# Altium project zynq_dev_V1.PrjPcb (part 3 of 3)

## Sheet [06] - MEMORY.SchDoc
size A3; DocumentNumber: 3; SheetNumber: 3; SheetTotal: 4
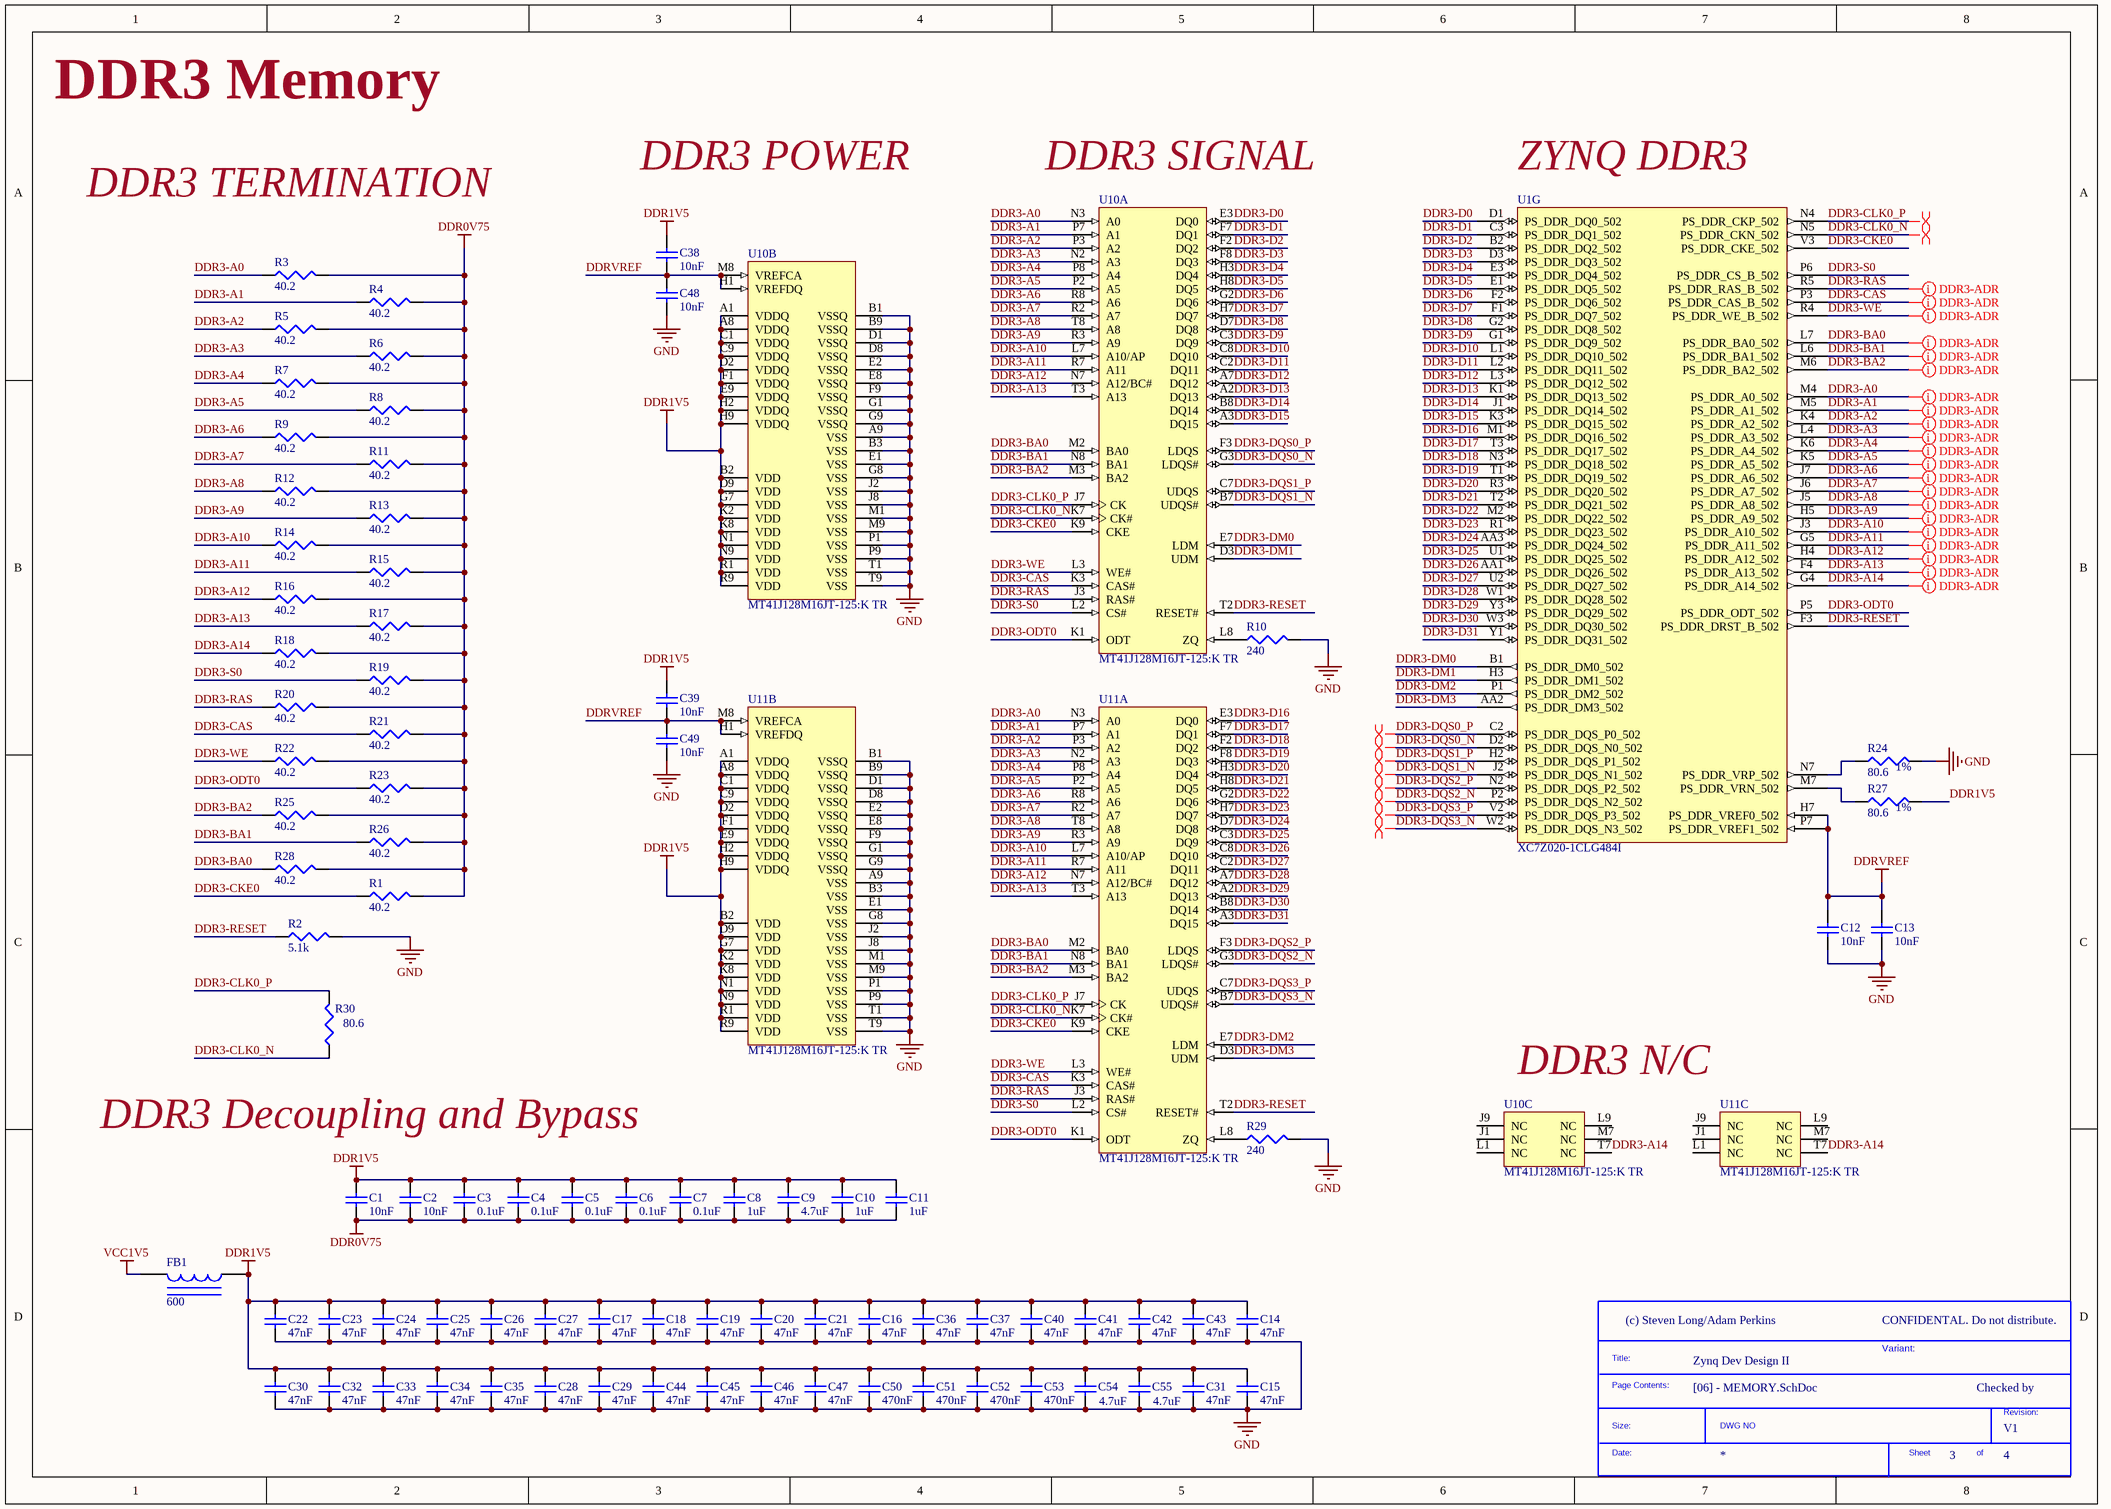
[diagram p5: [06] - MEMORY.SchDoc]

### Parts
(Parts that share a designator on the sheet are numbered #1, #2 ... from top to bottom, then left to right.)
*#6  SDTitleBlock  (value not drawn)  (graphical)
C1  value 10nF  [0402]  (hidden comment: Capacitor)
C2  value 10nF  [0402]  (hidden comment: Capacitor)
C3  value 0.1uF  [0402]  (hidden comment: Capacitor)
C4  value 0.1uF  [0402]  (hidden comment: Capacitor)
C5  value 0.1uF  [0402]  (hidden comment: Capacitor)
C6  value 0.1uF  [0402]  (hidden comment: Capacitor)
C7  value 0.1uF  [0402]  (hidden comment: Capacitor)
C8  value 1uF  [1608[0603]]  (hidden comment: Capacitor)
C9  value 4.7uF  [1608[0603]]  (hidden comment: Capacitor)
C10  value 1uF  [1608[0603]]  (hidden comment: Capacitor)
C11  value 1uF  [1608[0603]]  (hidden comment: Capacitor)
C12  value 10nF  [0402]  (hidden comment: Capacitor)
C13  value 10nF  [0402]  (hidden comment: Capacitor)
C14  value 47nF  [0402]  (hidden comment: Capacitor)
C15  value 47nF  [0402]  (hidden comment: Capacitor)
C16  value 47nF  [0402]  (hidden comment: Capacitor)
C17  value 47nF  [0402]  (hidden comment: Capacitor)
C18  value 47nF  [0402]  (hidden comment: Capacitor)
C19  value 47nF  [0402]  (hidden comment: Capacitor)
C20  value 47nF  [0402]  (hidden comment: Capacitor)
C21  value 47nF  [0402]  (hidden comment: Capacitor)
C22  value 47nF  [0402]  (hidden comment: Capacitor)
C23  value 47nF  [0402]  (hidden comment: Capacitor)
C24  value 47nF  [0402]  (hidden comment: Capacitor)
C25  value 47nF  [0402]  (hidden comment: Capacitor)
C26  value 47nF  [0402]  (hidden comment: Capacitor)
C27  value 47nF  [0402]  (hidden comment: Capacitor)
C28  value 47nF  [0402]  (hidden comment: Capacitor)
C29  value 47nF  [0402]  (hidden comment: Capacitor)
C30  value 47nF  [0402]  (hidden comment: Capacitor)
C31  value 47nF  [0402]  (hidden comment: Capacitor)
C32  value 47nF  [0402]  (hidden comment: Capacitor)
C33  value 47nF  [0402]  (hidden comment: Capacitor)
C34  value 47nF  [0402]  (hidden comment: Capacitor)
C35  value 47nF  [0402]  (hidden comment: Capacitor)
C36  value 47nF  [0402]  (hidden comment: Capacitor)
C37  value 47nF  [0402]  (hidden comment: Capacitor)
C38  value 10nF  [0402]  (hidden comment: Capacitor)
C39  value 10nF  [0402]  (hidden comment: Capacitor)
C40  value 47nF  [0402]  (hidden comment: Capacitor)
C41  value 47nF  [0402]  (hidden comment: Capacitor)
C42  value 47nF  [0402]  (hidden comment: Capacitor)
C43  value 47nF  [0402]  (hidden comment: Capacitor)
C44  value 47nF  [0402]  (hidden comment: Capacitor)
C45  value 47nF  [0402]  (hidden comment: Capacitor)
C46  value 47nF  [0402]  (hidden comment: Capacitor)
C47  value 47nF  [0402]  (hidden comment: Capacitor)
C48  value 10nF  [0402]  (hidden comment: Capacitor)
C49  value 10nF  [0402]  (hidden comment: Capacitor)
C50  value 470nF  [0402]  (hidden comment: Capacitor)
C51  value 470nF  [0402]  (hidden comment: Capacitor)
C52  value 470nF  [0402]  (hidden comment: Capacitor)
C53  value 470nF  [0402]  (hidden comment: Capacitor)
C54  value 4.7uF  [1608[0603]]  (hidden comment: Capacitor)
C55  value 4.7uF  [1608[0603]]  (hidden comment: Capacitor)
FB1  value 600  [6-0805_N]  (hidden comment: Ferrite Bead)
R1  value 40.2  [0402]  (hidden comment: Resistor)
R2  value 5.1k  [0402]  (hidden comment: Resistor)
R3  value 40.2  [0402]  (hidden comment: Resistor)
R4  value 40.2  [0402]  (hidden comment: Resistor)
R5  value 40.2  [0402]  (hidden comment: Resistor)
R6  value 40.2  [0402]  (hidden comment: Resistor)
R7  value 40.2  [0402]  (hidden comment: Resistor)
R8  value 40.2  [0402]  (hidden comment: Resistor)
R9  value 40.2  [0402]  (hidden comment: Resistor)
R10  value 240  [0402]  (hidden comment: Resistor)
R11  value 40.2  [0402]  (hidden comment: Resistor)
R12  value 40.2  [0402]  (hidden comment: Resistor)
R13  value 40.2  [0402]  (hidden comment: Resistor)
R14  value 40.2  [0402]  (hidden comment: Resistor)
R15  value 40.2  [0402]  (hidden comment: Resistor)
R16  value 40.2  [0402]  (hidden comment: Resistor)
R17  value 40.2  [0402]  (hidden comment: Resistor)
R18  value 40.2  [0402]  (hidden comment: Resistor)
R19  value 40.2  [0402]  (hidden comment: Resistor)
R20  value 40.2  [0402]  (hidden comment: Resistor)
R21  value 40.2  [0402]  (hidden comment: Resistor)
R22  value 40.2  [0402]  (hidden comment: Resistor)
R23  value 40.2  [0402]  (hidden comment: Resistor)
R24  value 80.6  Tolerance: 1%  [0402]  (hidden comment: Resistor)
R25  value 40.2  [0402]  (hidden comment: Resistor)
R26  value 40.2  [0402]  (hidden comment: Resistor)
R27  value 80.6  Tolerance: 1%  [0402]  (hidden comment: Resistor)
R28  value 40.2  [0402]  (hidden comment: Resistor)
R29  value 240  [0402]  (hidden comment: Resistor)
R30  value 80.6  [0402]  (hidden comment: Resistor)
U1  XC7Z020-1CLG484I  [CLG484]  (part G of 10)
U10  MT41J128M16JT-125:K TR  [MICT-JT-96]  (parts A,B,C of 3)
U11  MT41J128M16JT-125:K TR  [MICT-JT-96]  (parts A,B,C of 3)

### Nets
DDR0V75: C1.1 C2.1 C3.1 C4.1 C5.1 C6.1 C7.1 C8.1 C9.1 C10.1 C11.1 R1.2 R3.2 R4.2 R5.2 R6.2 R7.2 R8.2 R9.2 R11.2 R12.2 R13.2 R14.2 R15.2 R16.2 R17.2 R18.2 R19.2 R20.2 R21.2 R22.2 R23.2 R25.2 R26.2 R28.2
DDR1V5: C1.2 C2.2 C3.2 C4.2 C5.2 C6.2 C7.2 C8.2 C9.2 C10.2 C11.2 C14.2 C15.2 C16.2 C17.2 C18.2 C19.2 C20.2 C21.2 C22.2 C23.2 C24.2 C25.2 C26.2 C27.2 C28.2 C29.2 C30.2 C31.2 C32.2 C33.2 C34.2 C35.2 C36.2 C37.2 C38.2 C39.2 C40.2 C41.2 C42.2 C43.2 C44.2 C45.2 C46.2 C47.2 C50.2 C51.2 C52.2 C53.2 C54.2 C55.2 FB1.1 R27.2 U10.A1(VDDQ) U10.A8(VDDQ) U10.B2(VDD) U10.C1(VDDQ) U10.C9(VDDQ) U10.D2(VDDQ) U10.D9(VDD) U10.E9(VDDQ) U10.F1(VDDQ) U10.G7(VDD) U10.H2(VDDQ) U10.H9(VDDQ) U10.K2(VDD) U10.K8(VDD) U10.N1(VDD) U10.N9(VDD) U10.R1(VDD) U10.R9(VDD) U11.A1(VDDQ) U11.A8(VDDQ) U11.B2(VDD) U11.C1(VDDQ) U11.C9(VDDQ) U11.D2(VDDQ) U11.D9(VDD) U11.E9(VDDQ) U11.F1(VDDQ) U11.G7(VDD) U11.H2(VDDQ) U11.H9(VDDQ) U11.K2(VDD) U11.K8(VDD) U11.N1(VDD) U11.N9(VDD) U11.R1(VDD) U11.R9(VDD)
DDRVREF: C12.2 C13.2 C38.1 C39.1 C48.2 C49.2 U1.H7(PS_DDR_VREF0_502) U1.P7(PS_DDR_VREF1_502) U10.H1(VREFDQ) U10.M8(VREFCA) U11.H1(VREFDQ) U11.M8(VREFCA)
GND: C12.1 C13.1 C14.1 C15.1 C16.1 C17.1 C18.1 C19.1 C20.1 C21.1 C22.1 C23.1 C24.1 C25.1 C26.1 C27.1 C28.1 C29.1 C30.1 C31.1 C32.1 C33.1 C34.1 C35.1 C36.1 C37.1 C40.1 C41.1 C42.1 C43.1 C44.1 C45.1 C46.1 C47.1 C48.1 C49.1 C50.1 C51.1 C52.1 C53.1 C54.1 C55.1 R2.2 R10.2 R24.2 R29.2 U10.A9(VSS) U10.B1(VSSQ) U10.B3(VSS) U10.B9(VSSQ) U10.D1(VSSQ) U10.D8(VSSQ) U10.E1(VSS) U10.E2(VSSQ) U10.E8(VSSQ) U10.F9(VSSQ) U10.G1(VSSQ) U10.G8(VSS) U10.G9(VSSQ) U10.J2(VSS) U10.J8(VSS) U10.M1(VSS) U10.M9(VSS) U10.P1(VSS) U10.P9(VSS) U10.T1(VSS) U10.T9(VSS) U11.A9(VSS) U11.B1(VSSQ) U11.B3(VSS) U11.B9(VSSQ) U11.D1(VSSQ) U11.D8(VSSQ) U11.E1(VSS) U11.E2(VSSQ) U11.E8(VSSQ) U11.F9(VSSQ) U11.G1(VSSQ) U11.G8(VSS) U11.G9(VSSQ) U11.J2(VSS) U11.J8(VSS) U11.M1(VSS) U11.M9(VSS) U11.P1(VSS) U11.P9(VSS) U11.T1(VSS) U11.T9(VSS)
VCC1V5: FB1.2
DDR3-A0: R3.1 U1.M4(PS_DDR_A0_502) U10.N3(A0) U11.N3(A0)
DDR3-A1: R4.1 U1.M5(PS_DDR_A1_502) U10.P7(A1) U11.P7(A1)
DDR3-A2: R5.1 U1.K4(PS_DDR_A2_502) U10.P3(A2) U11.P3(A2)
DDR3-A3: R6.1 U1.L4(PS_DDR_A3_502) U10.N2(A3) U11.N2(A3)
DDR3-A4: R7.1 U1.K6(PS_DDR_A4_502) U10.P8(A4) U11.P8(A4)
DDR3-A5: R8.1 U1.K5(PS_DDR_A5_502) U10.P2(A5) U11.P2(A5)
DDR3-A6: R9.1 U1.J7(PS_DDR_A6_502) U10.R8(A6) U11.R8(A6)
DDR3-A7: R11.1 U1.J6(PS_DDR_A7_502) U10.R2(A7) U11.R2(A7)
DDR3-A8: R12.1 U1.J5(PS_DDR_A8_502) U10.T8(A8) U11.T8(A8)
DDR3-A9: R13.1 U1.H5(PS_DDR_A9_502) U10.R3(A9) U11.R3(A9)
DDR3-A10: R14.1 U1.J3(PS_DDR_A10_502) U10.L7(A10/AP) U11.L7(A10/AP)
DDR3-A11: R15.1 U1.G5(PS_DDR_A11_502) U10.R7(A11) U11.R7(A11)
DDR3-A12: R16.1 U1.H4(PS_DDR_A12_502) U10.N7(A12/BC#) U11.N7(A12/BC#)
DDR3-A13: R17.1 U1.F4(PS_DDR_A13_502) U10.T3(A13) U11.T3(A13)
DDR3-A14: R18.1 U1.G4(PS_DDR_A14_502) U10.T7(NC) U11.T7(NC)
DDR3-BA0: R28.1 U1.L7(PS_DDR_BA0_502) U10.M2(BA0) U11.M2(BA0)
DDR3-BA1: R26.1 U1.L6(PS_DDR_BA1_502) U10.N8(BA1) U11.N8(BA1)
DDR3-BA2: R25.1 U1.M6(PS_DDR_BA2_502) U10.M3(BA2) U11.M3(BA2)
DDR3-CAS: R21.1 U1.P3(PS_DDR_CAS_B_502) U10.K3(CAS#) U11.K3(CAS#)
DDR3-CKE0: R1.1 U1.V3(PS_DDR_CKE_502) U10.K9(CKE) U11.K9(CKE)
DDR3-CLK0_N: R30.1 U1.N5(PS_DDR_CKN_502) U10.K7(CK#) U11.K7(CK#)
DDR3-CLK0_P: R30.2 U1.N4(PS_DDR_CKP_502) U10.J7(CK) U11.J7(CK)
DDR3-D0: U1.D1(PS_DDR_DQ0_502) U10.E3(DQ0)
DDR3-D1: U1.C3(PS_DDR_DQ1_502) U10.F7(DQ1)
DDR3-D2: U1.B2(PS_DDR_DQ2_502) U10.F2(DQ2)
DDR3-D3: U1.D3(PS_DDR_DQ3_502) U10.F8(DQ3)
DDR3-D4: U1.E3(PS_DDR_DQ4_502) U10.H3(DQ4)
DDR3-D5: U1.E1(PS_DDR_DQ5_502) U10.H8(DQ5)
DDR3-D6: U1.F2(PS_DDR_DQ6_502) U10.G2(DQ6)
DDR3-D7: U1.F1(PS_DDR_DQ7_502) U10.H7(DQ7)
DDR3-D8: U1.G2(PS_DDR_DQ8_502) U10.D7(DQ8)
DDR3-D9: U1.G1(PS_DDR_DQ9_502) U10.C3(DQ9)
DDR3-D10: U1.L1(PS_DDR_DQ10_502) U10.C8(DQ10)
DDR3-D11: U1.L2(PS_DDR_DQ11_502) U10.C2(DQ11)
DDR3-D12: U1.L3(PS_DDR_DQ12_502) U10.A7(DQ12)
DDR3-D13: U1.K1(PS_DDR_DQ13_502) U10.A2(DQ13)
DDR3-D14: U1.J1(PS_DDR_DQ14_502) U10.B8(DQ14)
DDR3-D15: U1.K3(PS_DDR_DQ15_502) U10.A3(DQ15)
DDR3-D16: U1.M1(PS_DDR_DQ16_502) U11.E3(DQ0)
DDR3-D17: U1.T3(PS_DDR_DQ17_502) U11.F7(DQ1)
DDR3-D18: U1.N3(PS_DDR_DQ18_502) U11.F2(DQ2)
DDR3-D19: U1.T1(PS_DDR_DQ19_502) U11.F8(DQ3)
DDR3-D20: U1.R3(PS_DDR_DQ20_502) U11.H3(DQ4)
DDR3-D21: U1.T2(PS_DDR_DQ21_502) U11.H8(DQ5)
DDR3-D22: U1.M2(PS_DDR_DQ22_502) U11.G2(DQ6)
DDR3-D23: U1.R1(PS_DDR_DQ23_502) U11.H7(DQ7)
DDR3-D24: U1.AA3(PS_DDR_DQ24_502) U11.D7(DQ8)
DDR3-D25: U1.U1(PS_DDR_DQ25_502) U11.C3(DQ9)
DDR3-D26: U1.AA1(PS_DDR_DQ26_502) U11.C8(DQ10)
DDR3-D27: U1.U2(PS_DDR_DQ27_502) U11.C2(DQ11)
DDR3-D28: U1.W1(PS_DDR_DQ28_502) U11.A7(DQ12)
DDR3-D29: U1.Y3(PS_DDR_DQ29_502) U11.A2(DQ13)
DDR3-D30: U1.W3(PS_DDR_DQ30_502) U11.B8(DQ14)
DDR3-D31: U1.Y1(PS_DDR_DQ31_502) U11.A3(DQ15)
DDR3-DM0: U1.B1(PS_DDR_DM0_502) U10.E7(LDM)
DDR3-DM1: U1.H3(PS_DDR_DM1_502) U10.D3(UDM)
DDR3-DM2: U1.P1(PS_DDR_DM2_502) U11.E7(LDM)
DDR3-DM3: U1.AA2(PS_DDR_DM3_502) U11.D3(UDM)
DDR3-DQS0_N: U1.D2(PS_DDR_DQS_N0_502) U10.G3(LDQS#)
DDR3-DQS0_P: U1.C2(PS_DDR_DQS_P0_502) U10.F3(LDQS)
DDR3-DQS1_N: U1.J2(PS_DDR_DQS_N1_502) U10.B7(UDQS#)
DDR3-DQS1_P: U1.H2(PS_DDR_DQS_P1_502) U10.C7(UDQS)
DDR3-DQS2_N: U1.P2(PS_DDR_DQS_N2_502) U11.G3(LDQS#)
DDR3-DQS2_P: U1.N2(PS_DDR_DQS_P2_502) U11.F3(LDQS)
DDR3-DQS3_N: U1.W2(PS_DDR_DQS_N3_502) U11.B7(UDQS#)
DDR3-DQS3_P: U1.V2(PS_DDR_DQS_P3_502) U11.C7(UDQS)
DDR3-ODT0: R23.1 U1.P5(PS_DDR_ODT_502) U10.K1(ODT) U11.K1(ODT)
DDR3-RAS: R20.1 U1.R5(PS_DDR_RAS_B_502) U10.J3(RAS#) U11.J3(RAS#)
DDR3-RESET: R2.1 U1.F3(PS_DDR_DRST_B_502) U10.T2(RESET#) U11.T2(RESET#)
DDR3-S0: R19.1 U1.P6(PS_DDR_CS_B_502) U10.L2(CS#) U11.L2(CS#)
DDR3-WE: R22.1 U1.R4(PS_DDR_WE_B_502) U10.L3(WE#) U11.L3(WE#)
NetR10_1: R10.1 U10.L8(ZQ)
NetR24_1: R24.1 U1.N7(PS_DDR_VRP_502)
NetR27_1: R27.1 U1.M7(PS_DDR_VRN_502)
NetR29_1: R29.1 U11.L8(ZQ)

Not connected (* = marked no-connect by the designer): U10 J1(NC) J9(NC) L1(NC) L9(NC) M7(NC); U11 J1(NC) J9(NC) L1(NC) L9(NC) M7(NC)

### Layout directives
differential pair: DDR3-CLK0_N, DDR3-CLK0_P, DDR3-DQS0_N, DDR3-DQS0_P, DDR3-DQS1_N, DDR3-DQS1_P, DDR3-DQS2_N, DDR3-DQS2_P, DDR3-DQS3_N, DDR3-DQS3_P
net class DDR3-ADR: DDR3-A0, DDR3-A1, DDR3-A2, DDR3-A3, DDR3-A4, DDR3-A5, DDR3-A6, DDR3-A7, DDR3-A8, DDR3-A9, DDR3-A10, DDR3-A11, DDR3-A12, DDR3-A13, DDR3-A14, DDR3-BA0, DDR3-BA1, DDR3-BA2, DDR3-CAS, DDR3-RAS, DDR3-WE

### Notes on the sheet
- DDR3 Memory
- DDR3 POWER
- (near U10) DDR3 SIGNAL
- (near U1) ZYNQ DDR3
- DDR3 TERMINATION
- DDR3 N/C
- DDR3 Decoupling and Bypass
- CONFIDENTAL. Do not distribute.
- CLOCKS (CPU & PCIE)
- Variant:
- Checked by
- (in symbol SDTitleBlock) Title:; Page Contents:; Revision:; Size:; DWG NO; Date:; Sheet; of

### Library data of the parts
C1-C55 = Cap Semi: Capacitor (Semiconductor SIM Model); Published: 8-Jun-2000; LatestRevisionDate: 29-May-2009; LatestRevisionNote: IPC-7351 Footprint Added.; PackageReference: C1206; Publisher: Altium Limited; PackageDescription: Chip Capacitor
FB1 = Inductor Iron: Magnetic-Core Inductor; Published: 24-Mar-1999; LatestRevisionDate: 17-Jul-2002; LatestRevisionNote: Re-released for DXP Platform.; PackageReference: AXIAL-0.9; Publisher: Altium Limited; PackageDescription: Axial Device, Thru-Hole; 2 Leads; 0.9 in Pin Spacing
R1-R29 = Res3: Published: 8-Jun-2000; LatestRevisionDate: 29-May-2009; LatestRevisionNote: IPC-7351 Footprint Added.; PackageReference: J1-0603; Publisher: Altium Limited; PackageDescription: Chip Resistor
R30 = Res3: Tolerance: 1%; Published: 8-Jun-2000; LatestRevisionDate: 29-May-2009; LatestRevisionNote: IPC-7351 Footprint Added.; PackageReference: J1-0603; Publisher: Altium Limited; PackageDescription: Chip Resistor
U1 = XC7Z020-1CLG484I: as U1 on sheet [04] - ZYNQ POWER AND JTAG; Supplier 1: Digi-Key; Manufacturer Part Number: XC7Z020-1CLG484I; RoHS: RoHS Compliant; Category: Integrated Circuits (ICs); Stock 1: 188; Pricing 1: 1=128.75 (USD); Packaging: Tray; MCU Flash: -; Operating Temperature: -40°C ~ 100°C; Package / Case: 484-LFBGA, CSPBGA; Supplier Device Package: 484-CSPBGA (19x19); ComponentLink1URL: http://www.xilinx.com/support/documentation/data_sheets/ds190-Zynq-7000-Overview.pdf; ComponentLink1Description: http://www.xilinx.com/support/documentation/data_sheets/ds190-Zynq-7000-Overview.pdf; Supplier Part Number 1: 122-1849-ND
U10 U11 = MT41J128M16JT-125:K TR: IC DDR3 SDRAM 2GBIT 96FBGA; Manufacturer: Micron Technology Inc.; Format - Memory: RAM; Memory Size: 2G (128M x 16); Speed: 1.25ns; Interface: Parallel; Voltage - Supply: 1.425 V ~ 1.575 V; Supplier 1: Digi-Key; Manufacturer Part Number: MT41J128M16JT-125:K TR; RoHS: RoHS Compliant; Category: Integrated Circuits (ICs); Stock 1: 3472; Pricing 1: 1=4.47, 10=4.054, 25=3.966, 50=3.944, 100=3.538, 250=3.524, 500=3.394, 1000=3.228 (USD); Packaging: Cut Tape (CT); Memory Type: DDR3 SDRAM; Operating Temperature: 0°C ~ 95°C (TC); Package / Case: 96-TFBGA; Supplier Device Package: 96-FBGA (8x14); ComponentLink1URL: http://www.micron.com/~/media/Documents/Products/Data%20Sheet/DRAM/DDR3/2Gb_DDR3_SDRAM.pdf; ComponentLink1Description: http://www.micron.com/~/media/Documents/Products/Data%20Sheet/DRAM/DDR3/2Gb_DDR3_SDRAM.pdf; Supplier Part Number 1: 557-1611-1-ND

## Sheet [07] - ZYNQ IO.SchDoc
size A3; DocumentNumber: 3; SheetNumber: 3; SheetTotal: 4
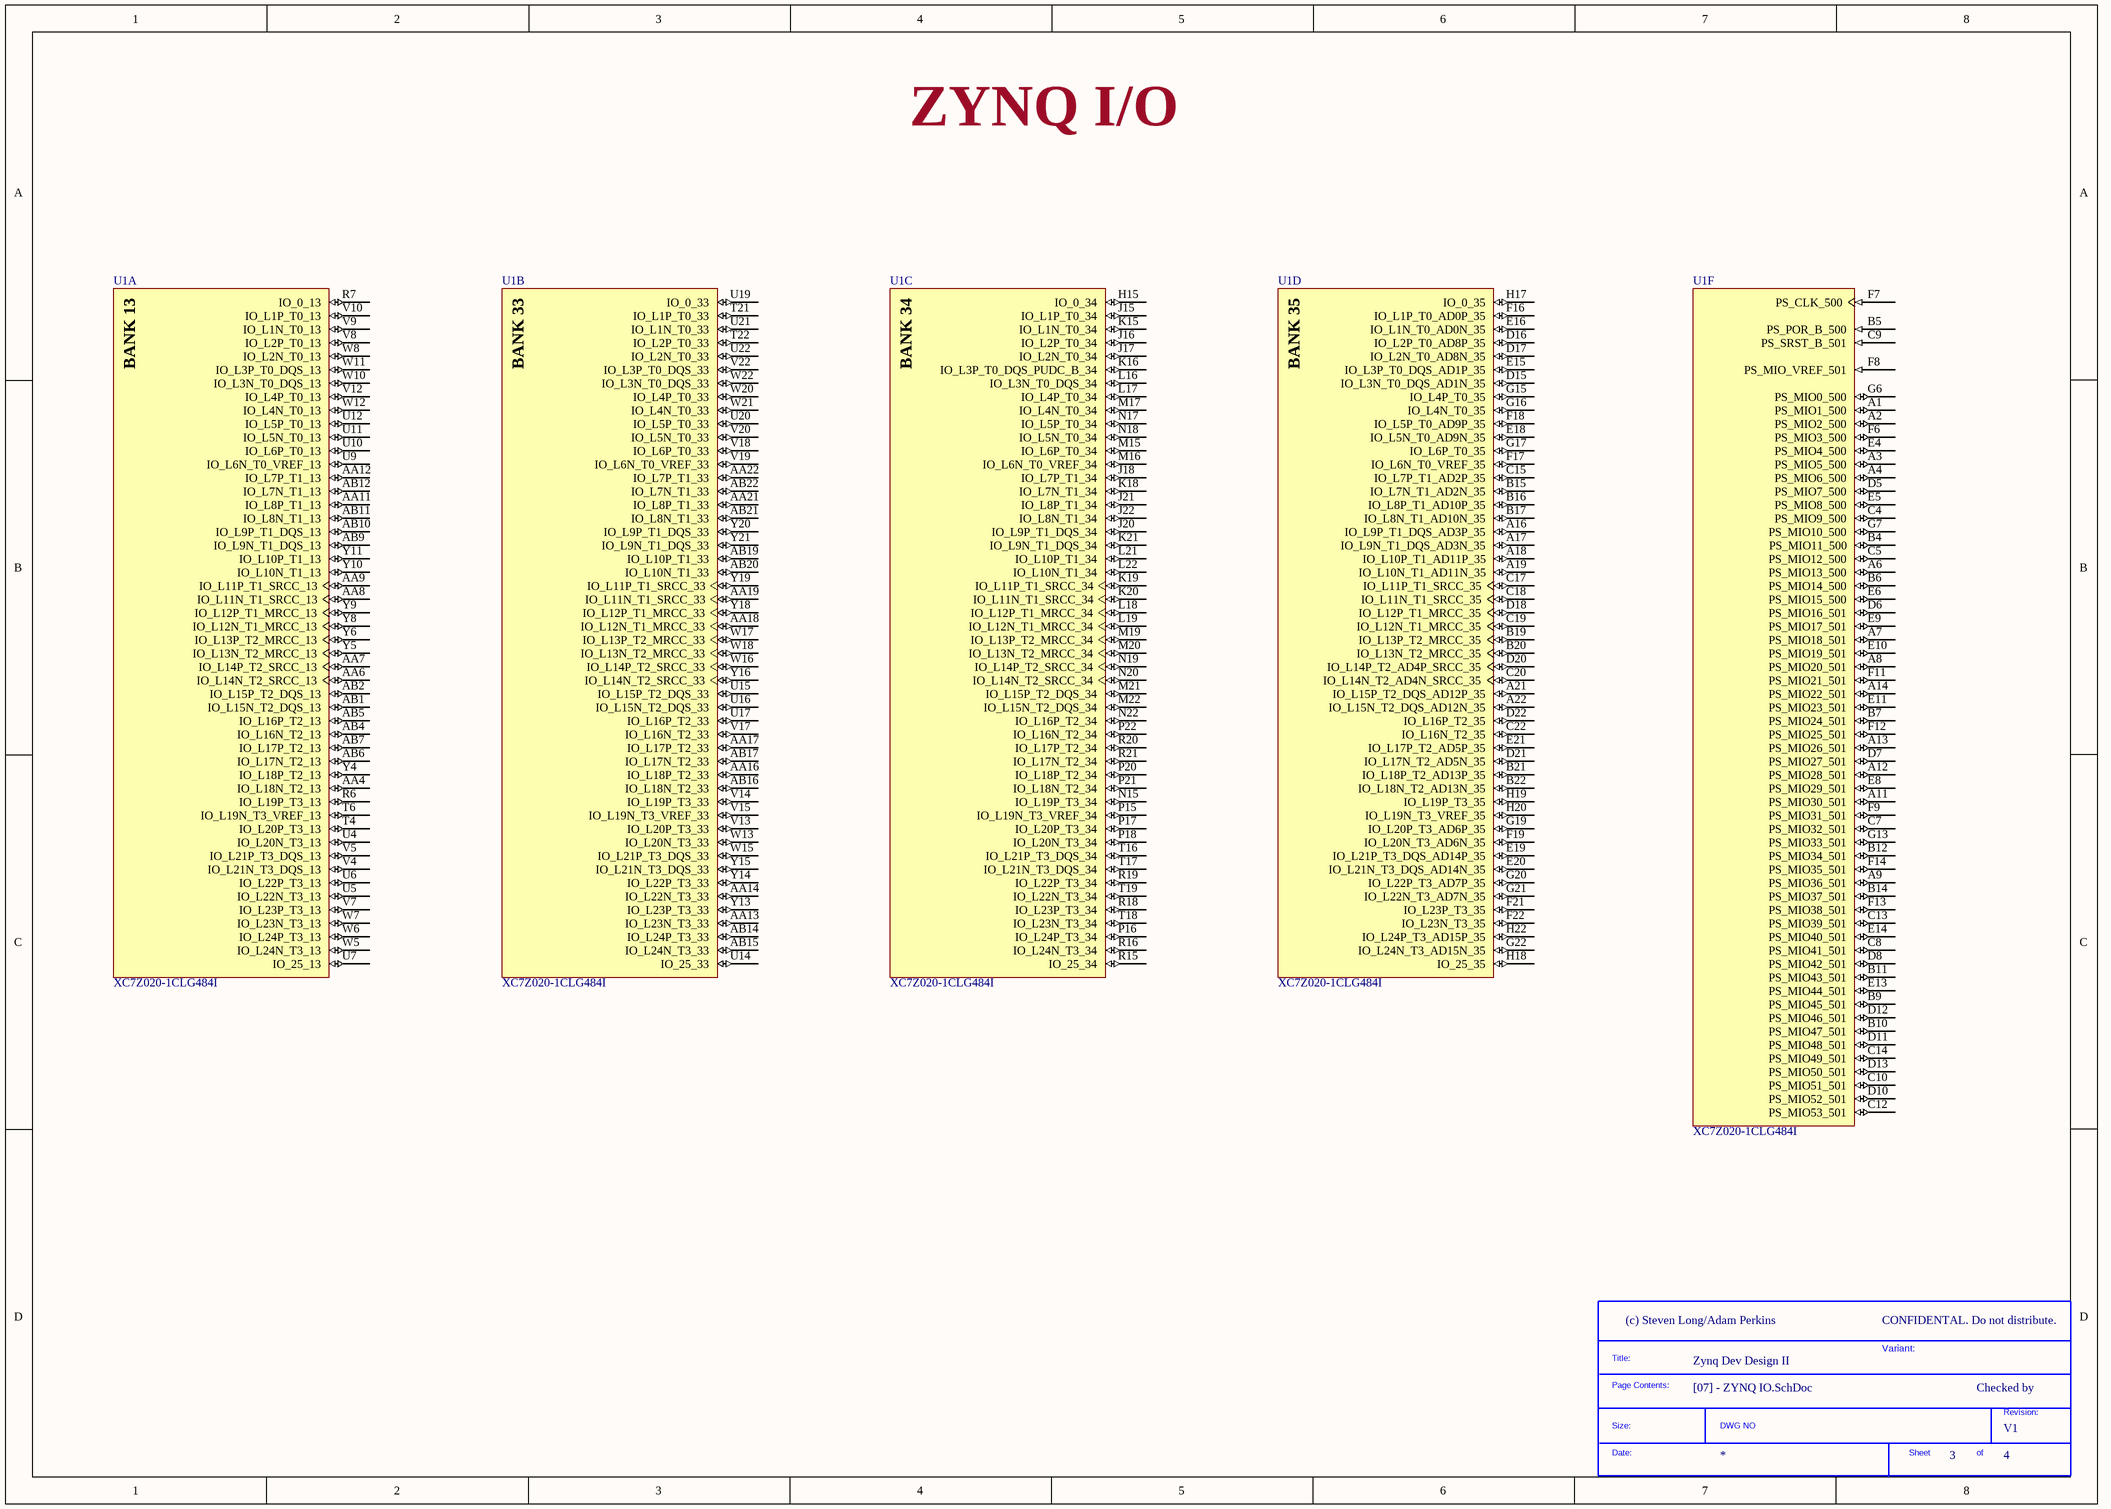
[diagram p6: [07] - ZYNQ IO.SchDoc]

### Parts
(Parts that share a designator on the sheet are numbered #1, #2 ... from top to bottom, then left to right.)
*#7  SDTitleBlock  (value not drawn)  (graphical)
U1  XC7Z020-1CLG484I  [CLG484]  (parts A,B,C,D,F of 10)

### Nets

Not connected (* = marked no-connect by the designer): U1 A1(PS_MIO1_500) A2(PS_MIO2_500) A3(PS_MIO5_500) A4(PS_MIO6_500) A6(PS_MIO13_500) A7(PS_MIO18_501) A8(PS_MIO20_501) A9(PS_MIO36_501) A11(PS_MIO30_501) A12(PS_MIO28_501) A13(PS_MIO26_501) A14(PS_MIO22_501) A16(IO_L9P_T1_DQS_AD3P_35) A17(IO_L9N_T1_DQS_AD3N_35) A18(IO_L10P_T1_AD11P_35) A19(IO_L10N_T1_AD11N_35) A21(IO_L15P_T2_DQS_AD12P_35) A22(IO_L15N_T2_DQS_AD12N_35) AA4(IO_L18N_T2_13) AA6(IO_L14N_T2_SRCC_13) AA7(IO_L14P_T2_SRCC_13) AA8(IO_L11N_T1_SRCC_13) AA9(IO_L11P_T1_SRCC_13) AA11(IO_L8P_T1_13) AA12(IO_L7P_T1_13) AA13(IO_L23N_T3_33) AA14(IO_L22N_T3_33) AA16(IO_L18P_T2_33) AA17(IO_L17P_T2_33) AA18(IO_L12N_T1_MRCC_33) AA19(IO_L11N_T1_SRCC_33) AA21(IO_L8P_T1_33) AA22(IO_L7P_T1_33) AB1(IO_L15N_T2_DQS_13) AB2(IO_L15P_T2_DQS_13) AB4(IO_L16N_T2_13) AB5(IO_L16P_T2_13) AB6(IO_L17N_T2_13) AB7(IO_L17P_T2_13) AB9(IO_L9N_T1_DQS_13) AB10(IO_L9P_T1_DQS_13) AB11(IO_L8N_T1_13) AB12(IO_L7N_T1_13) AB14(IO_L24P_T3_33) AB15(IO_L24N_T3_33) AB16(IO_L18N_T2_33) AB17(IO_L17N_T2_33) AB19(IO_L10P_T1_33) AB20(IO_L10N_T1_33) AB21(IO_L8N_T1_33) AB22(IO_L7N_T1_33) B4(PS_MIO11_500) B5(PS_POR_B_500) B6(PS_MIO14_500) B7(PS_MIO24_501) B9(PS_MIO45_501) B10(PS_MIO47_501) B11(PS_MIO43_501) B12(PS_MIO34_501) B14(PS_MIO37_501) B15(IO_L7N_T1_AD2N_35) B16(IO_L8P_T1_AD10P_35) B17(IO_L8N_T1_AD10N_35) B19(IO_L13P_T2_MRCC_35) B20(IO_L13N_T2_MRCC_35) B21(IO_L18P_T2_AD13P_35) B22(IO_L18N_T2_AD13N_35) C4(PS_MIO9_500) C5(PS_MIO12_500) C7(PS_MIO32_501) C8(PS_MIO41_501) C9(PS_SRST_B_501) C10(PS_MIO51_501) C12(PS_MIO53_501) C13(PS_MIO39_501) C14(PS_MIO49_501) C15(IO_L7P_T1_AD2P_35) C17(IO_L11P_T1_SRCC_35) C18(IO_L11N_T1_SRCC_35) C19(IO_L12N_T1_MRCC_35) C20(IO_L14N_T2_AD4N_SRCC_35) C22(IO_L16N_T2_35) D5(PS_MIO7_500) D6(PS_MIO16_501) D7(PS_MIO27_501) D8(PS_MIO42_501) D10(PS_MIO52_501) D11(PS_MIO48_501) D12(PS_MIO46_501) D13(PS_MIO50_501) D15(IO_L3N_T0_DQS_AD1N_35) D16(IO_L2P_T0_AD8P_35) D17(IO_L2N_T0_AD8N_35) D18(IO_L12P_T1_MRCC_35) D20(IO_L14P_T2_AD4P_SRCC_35) D21(IO_L17N_T2_AD5N_35) D22(IO_L16P_T2_35) E4(PS_MIO4_500) E5(PS_MIO8_500) E6(PS_MIO15_500) E8(PS_MIO29_501) E9(PS_MIO17_501) E10(PS_MIO19_501) E11(PS_MIO23_501) E13(PS_MIO44_501) E14(PS_MIO40_501) E15(IO_L3P_T0_DQS_AD1P_35) E16(IO_L1N_T0_AD0N_35) E18(IO_L5N_T0_AD9N_35) E19(IO_L21P_T3_DQS_AD14P_35) E20(IO_L21N_T3_DQS_AD14N_35) E21(IO_L17P_T2_AD5P_35) F6(PS_MIO3_500) F7(PS_CLK_500) F8(PS_MIO_VREF_501) F9(PS_MIO31_501) F11(PS_MIO21_501) F12(PS_MIO25_501) F13(PS_MIO38_501) F14(PS_MIO35_501) F16(IO_L1P_T0_AD0P_35) F17(IO_L6N_T0_VREF_35) F18(IO_L5P_T0_AD9P_35) F19(IO_L20N_T3_AD6N_35) F21(IO_L23P_T3_35) F22(IO_L23N_T3_35) G6(PS_MIO0_500) G7(PS_MIO10_500) G13(PS_MIO33_501) G15(IO_L4P_T0_35) G16(IO_L4N_T0_35) G17(IO_L6P_T0_35) G19(IO_L20P_T3_AD6P_35) G20(IO_L22P_T3_AD7P_35) G21(IO_L22N_T3_AD7N_35) G22(IO_L24N_T3_AD15N_35) H15(IO_0_34) H17(IO_0_35) H18(IO_25_35) H19(IO_L19P_T3_35) H20(IO_L19N_T3_VREF_35) H22(IO_L24P_T3_AD15P_35) J15(IO_L1P_T0_34) J16(IO_L2P_T0_34) J17(IO_L2N_T0_34) J18(IO_L7P_T1_34) J20(IO_L9P_T1_DQS_34) J21(IO_L8P_T1_34) J22(IO_L8N_T1_34) K15(IO_L1N_T0_34) K16(IO_L3P_T0_DQS_PUDC_B_34) K18(IO_L7N_T1_34) K19(IO_L11P_T1_SRCC_34) K20(IO_L11N_T1_SRCC_34) K21(IO_L9N_T1_DQS_34) L16(IO_L3N_T0_DQS_34) L17(IO_L4P_T0_34) L18(IO_L12P_T1_MRCC_34) L19(IO_L12N_T1_MRCC_34) L21(IO_L10P_T1_34) L22(IO_L10N_T1_34) M15(IO_L6P_T0_34) M16(IO_L6N_T0_VREF_34) M17(IO_L4N_T0_34) M19(IO_L13P_T2_MRCC_34) M20(IO_L13N_T2_MRCC_34) M21(IO_L15P_T2_DQS_34) M22(IO_L15N_T2_DQS_34) N15(IO_L19P_T3_34) N17(IO_L5P_T0_34) N18(IO_L5N_T0_34) N19(IO_L14P_T2_SRCC_34) N20(IO_L14N_T2_SRCC_34) N22(IO_L16P_T2_34) P15(IO_L19N_T3_VREF_34) P16(IO_L24P_T3_34) P17(IO_L20P_T3_34) P18(IO_L20N_T3_34) P20(IO_L18P_T2_34) P21(IO_L18N_T2_34) P22(IO_L16N_T2_34) R6(IO_L19P_T3_13) R7(IO_0_13) R15(IO_25_34) R16(IO_L24N_T3_34) R18(IO_L23P_T3_34) R19(IO_L22P_T3_34) R20(IO_L17P_T2_34) R21(IO_L17N_T2_34) T4(IO_L20P_T3_13) T6(IO_L19N_T3_VREF_13) T16(IO_L21P_T3_DQS_34) T17(IO_L21N_T3_DQS_34) T18(IO_L23N_T3_34) T19(IO_L22N_T3_34) T21(IO_L1P_T0_33) T22(IO_L2P_T0_33) U4(IO_L20N_T3_13) U5(IO_L22N_T3_13) U6(IO_L22P_T3_13) U7(IO_25_13) U9(IO_L6N_T0_VREF_13) U10(IO_L6P_T0_13) U11(IO_L5N_T0_13) U12(IO_L5P_T0_13) U14(IO_25_33) U15(IO_L15P_T2_DQS_33) U16(IO_L15N_T2_DQS_33) U17(IO_L16P_T2_33) U19(IO_0_33) U20(IO_L5P_T0_33) U21(IO_L1N_T0_33) U22(IO_L2N_T0_33) V4(IO_L21N_T3_DQS_13) V5(IO_L21P_T3_DQS_13) V7(IO_L23P_T3_13) V8(IO_L2P_T0_13) V9(IO_L1N_T0_13) V10(IO_L1P_T0_13) V12(IO_L4P_T0_13) V13(IO_L20P_T3_33) V14(IO_L19P_T3_33) V15(IO_L19N_T3_VREF_33) V17(IO_L16N_T2_33) V18(IO_L6P_T0_33) V19(IO_L6N_T0_VREF_33) V20(IO_L5N_T0_33) V22(IO_L3P_T0_DQS_33) W5(IO_L24N_T3_13) W6(IO_L24P_T3_13) W7(IO_L23N_T3_13) W8(IO_L2N_T0_13) W10(IO_L3N_T0_DQS_13) W11(IO_L3P_T0_DQS_13) W12(IO_L4N_T0_13) W13(IO_L20N_T3_33) W15(IO_L21P_T3_DQS_33) W16(IO_L14P_T2_SRCC_33) W17(IO_L13P_T2_MRCC_33) W18(IO_L13N_T2_MRCC_33) W20(IO_L4P_T0_33) W21(IO_L4N_T0_33) W22(IO_L3N_T0_DQS_33) Y4(IO_L18P_T2_13) Y5(IO_L13N_T2_MRCC_13) Y6(IO_L13P_T2_MRCC_13) Y8(IO_L12N_T1_MRCC_13) Y9(IO_L12P_T1_MRCC_13) Y10(IO_L10N_T1_13) Y11(IO_L10P_T1_13) Y13(IO_L23P_T3_33) Y14(IO_L22P_T3_33) Y15(IO_L21N_T3_DQS_33) Y16(IO_L14N_T2_SRCC_33) Y18(IO_L12P_T1_MRCC_33) Y19(IO_L11P_T1_SRCC_33) Y20(IO_L9P_T1_DQS_33) Y21(IO_L9N_T1_DQS_33)

### Notes on the sheet
- ZYNQ I/O
- CONFIDENTAL. Do not distribute.
- CLOCKS (CPU & PCIE)
- Variant:
- Checked by
- (in symbol SDTitleBlock) Title:; Page Contents:; Revision:; Size:; DWG NO; Date:; Sheet; of
- (in symbol XC7Z020-1CLG484I, part A) BANK 13
- (in symbol XC7Z020-1CLG484I, part B) BANK 33
- (in symbol XC7Z020-1CLG484I, part C) BANK 34
- (in symbol XC7Z020-1CLG484I, part D) BANK 35

### Library data of the parts
U1 = XC7Z020-1CLG484I: IC SOC CORTEX-A9 ARTIX-7 484BGA; Manufacturer: Xilinx Inc.; Architecture: MCU, FPGA; Core Processor: Dual ARM® Cortex®-A9 MPCore™ with CoreSight™; MCU RAM: 256KB; Peripherals: DMA; Connectivity: CAN, EBI/EMI, Ethernet, I²C, MMC/SD/SDIO, SPI, UART/USART, USB OTG; Speed: 667MHz; Primary Attributes: Artix™-7 FPGA, 85K Logic Cells; Number of I/O: 130; Supplier 1: Digi-Key; Manufacturer Part Number: XC7Z020-1CLG484I; RoHS: RoHS Compliant; Category: Integrated Circuits (ICs); Stock 1: 188; Pricing 1: 1=128.75 (USD); Packaging: Tray; MCU Flash: -; Operating Temperature: -40°C ~ 100°C; Package / Case: 484-LFBGA, CSPBGA; Supplier Device Package: 484-CSPBGA (19x19); ComponentLink1URL: http://www.xilinx.com/support/documentation/data_sheets/ds190-Zynq-7000-Overview.pdf; ComponentLink1Description: http://www.xilinx.com/support/documentation/data_sheets/ds190-Zynq-7000-Overview.pdf; Supplier Part Number 1: 122-1849-ND

## Sheet [08] - SD_Card and Ethernet.SchDoc
size A3; DocumentNumber: 3; SheetNumber: 3; SheetTotal: 4
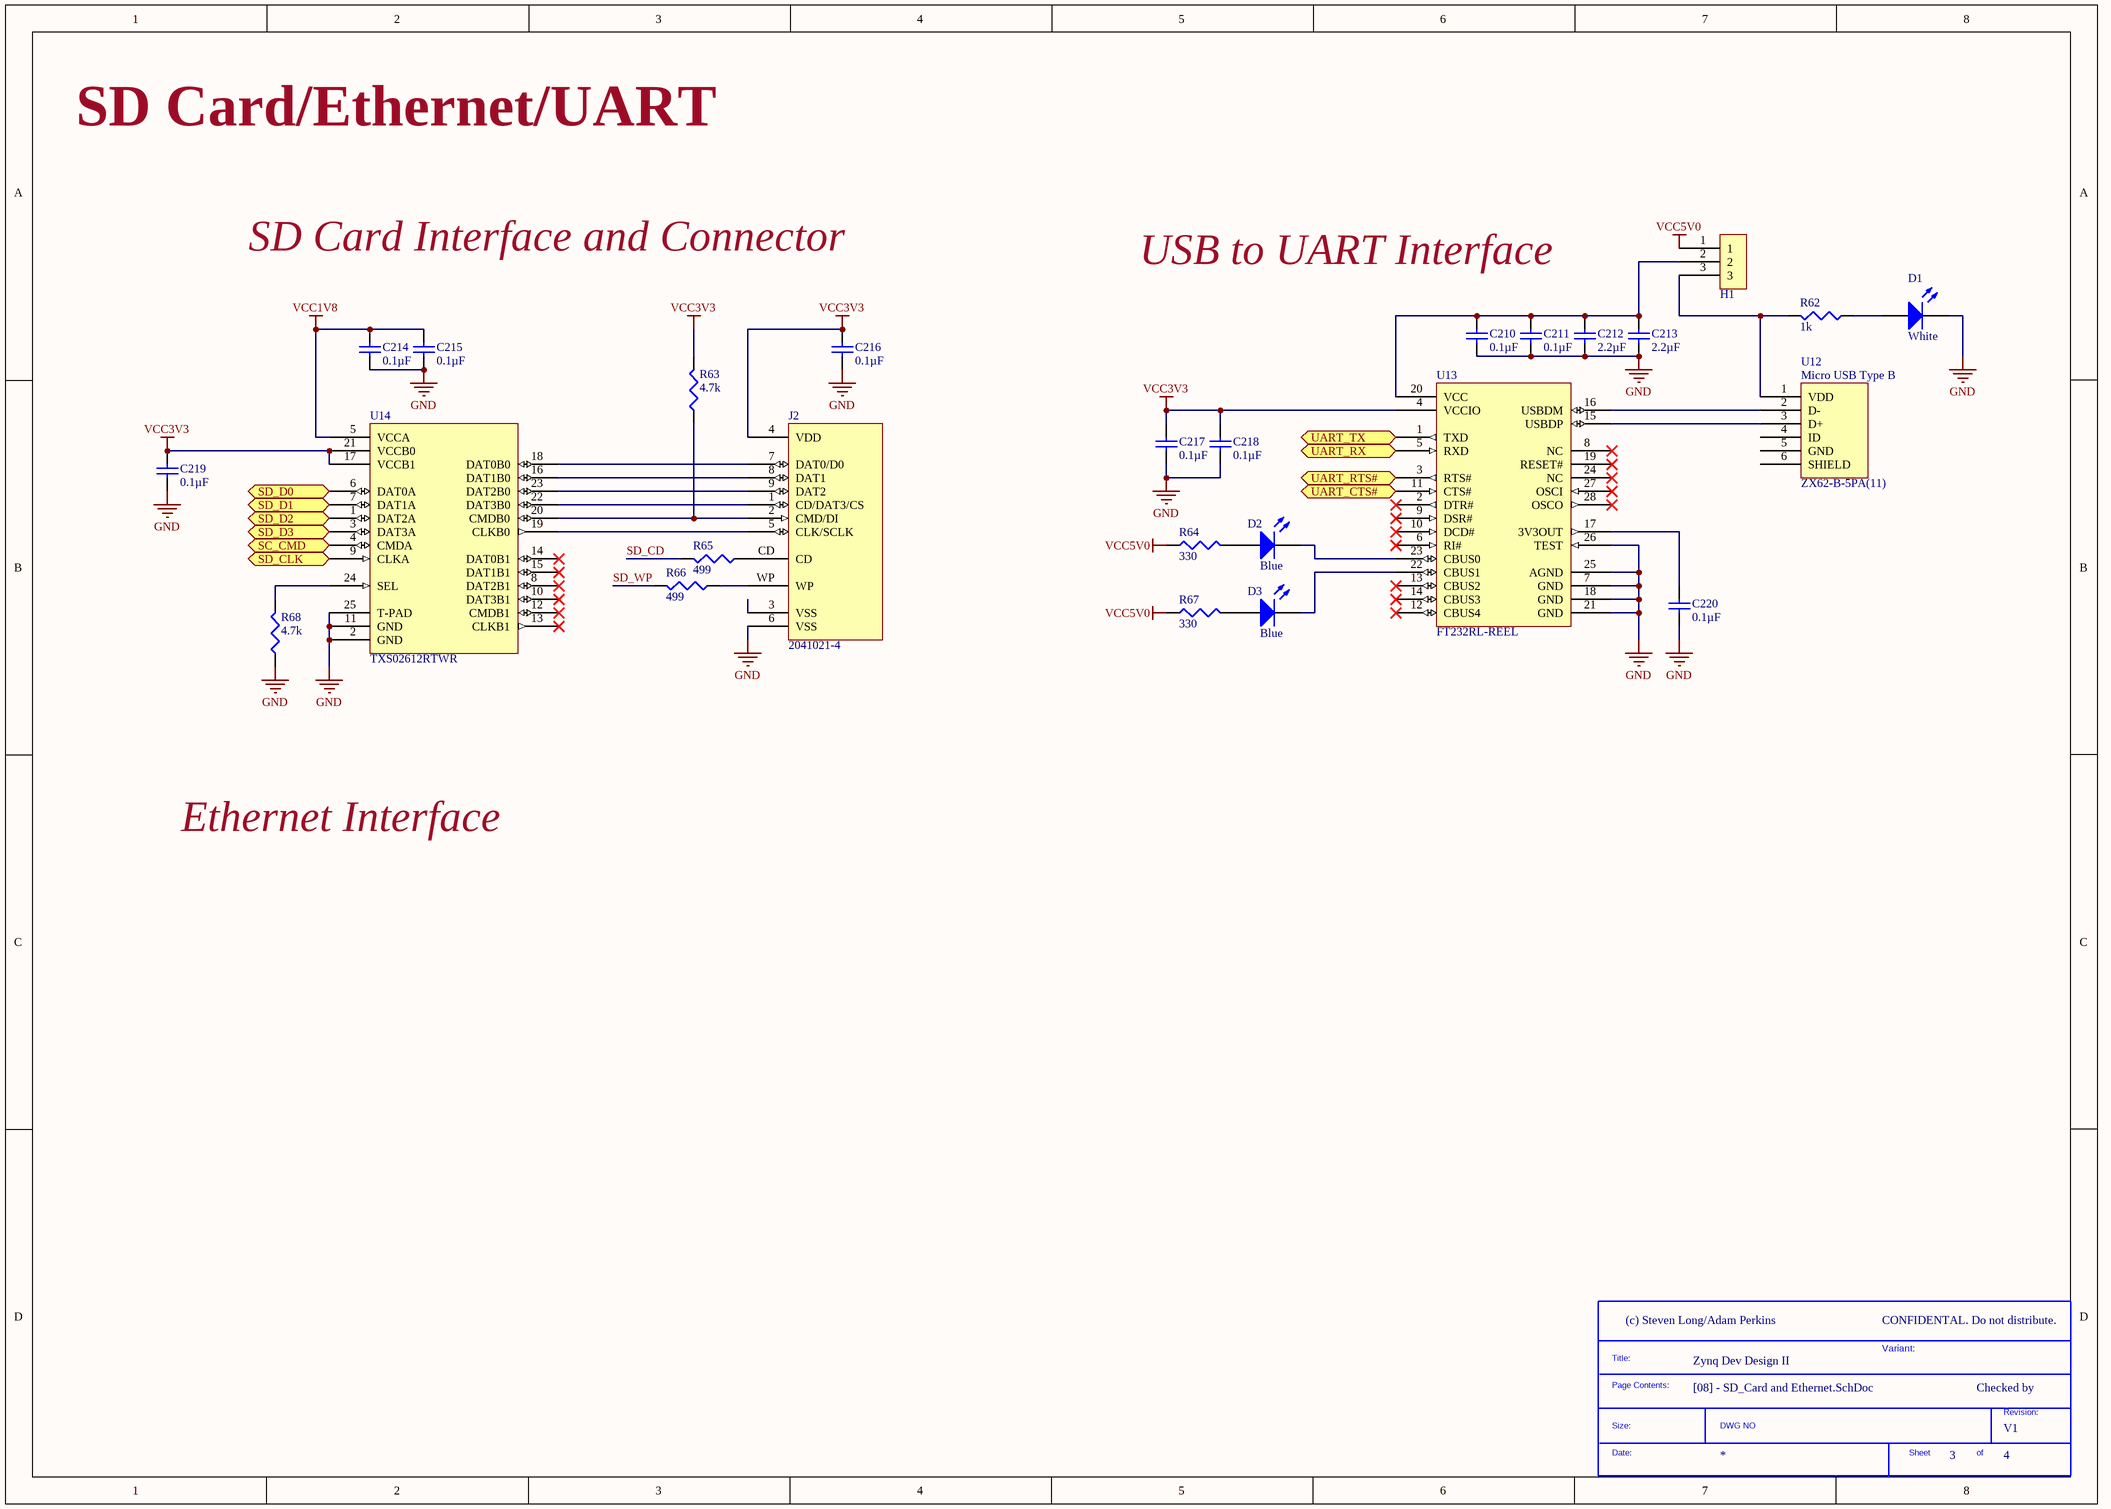
[diagram p7: [08] - SD_Card and Ethernet.SchDoc]

### Parts
(Parts that share a designator on the sheet are numbered #1, #2 ... from top to bottom, then left to right.)
*#8  SDTitleBlock  (value not drawn)  (graphical)
C210  Capacitance: 0.1µF  [CAP-0603]  (hidden comment: GRM188R71C104KA01D)
C211  Capacitance: 0.1µF  [CAP-0603]  (hidden comment: GRM188R71C104KA01D)
C212  Capacitance: 2.2µF  [CAP-0603]  (hidden comment: GRM188R71A225KE15D)
C213  Capacitance: 2.2µF  [CAP-0603]  (hidden comment: GRM188R71A225KE15D)
C214  Capacitance: 0.1µF  [CAP-0402]  (hidden comment: CGA2B1X7R1C104K050BC)
C215  Capacitance: 0.1µF  [CAP-0402]  (hidden comment: CGA2B1X7R1C104K050BC)
C216  Capacitance: 0.1µF  [CAP-0402]  (hidden comment: CGA2B1X7R1C104K050BC)
C217  Capacitance: 0.1µF  [CAP-0603]  (hidden comment: GRM188R71C104KA01D)
C218  Capacitance: 0.1µF  [CAP-0603]  (hidden comment: GRM188R71C104KA01D)
C219  Capacitance: 0.1µF  [CAP-0402]  (hidden comment: CGA2B1X7R1C104K050BC)
C220  Capacitance: 0.1µF  [CAP-0603]  (hidden comment: GRM188R71C104KA01D)
D1  Color: White  (hidden comment: SMLE12WBC7W1)
D2  Color: Blue  (hidden comment: LB Q39E-N1OO-35-1)
D3  Color: Blue  (hidden comment: LB Q39E-N1OO-35-1)
H1  68001-203HLF  (value not drawn)
J2  2041021-4
R62  Resistance (Ohms): 1k  [R0603]  (hidden comment: ERJ-3EKF1001V)
R63  Resistance (Ohms): 4.7k  [R0603]  (hidden comment: ERJ-3EKF4701V)
R64  Resistance (Ohms): 330  [R0603]  (hidden comment: ERJ-3EKF3300V)
R65  Resistance (Ohms): 499  [CAP-0603]  (hidden comment: ERJ-3EKF4990V)
R66  Resistance (Ohms): 499  [CAP-0603]  (hidden comment: ERJ-3EKF4990V)
R67  Resistance (Ohms): 330  [R0603]  (hidden comment: ERJ-3EKF3300V)
R68  Resistance (Ohms): 4.7k  [R0603]  (hidden comment: ERJ-3EKF4701V)
U12  ZX62-B-5PA(11)
U13  FT232RL-REEL
U14  TXS02612RTWR

### Ports
SC_CMD (bidir), SD_CLK (bidir), SD_D0 (bidir), SD_D1 (bidir), SD_D2 (bidir), SD_D3 (bidir), UART_CTS# (bidir), UART_RTS# (bidir), UART_RX (bidir), UART_TX (bidir)

### Nets
GND: C210.2 C211.2 C212.2 C213.2 C214.2 C215.2 C216.2 C217.2 C218.2 C219.2 C220.2 D1.2(K) J2.6(VSS) R68.1 U13.7(GND) U13.18(GND) U13.21(GND) U13.25(AGND) U13.26(TEST) U14.2(GND) U14.11(GND) U14.25(T-PAD)
VCC1V8: C214.1 C215.1 U14.5(VCCA)
VCC3V3: C216.1 C217.1 C218.1 C219.1 J2.4(VDD) R63.2 U13.4(VCCIO) U14.17(VCCB1) U14.21(VCCB0)
VCC5V0: H1.1 R64.1 R67.1
SD_CD: R65.2
SD_WP: R66.2
NetC210_1: C210.1 C211.1 C212.1 C213.1 H1.2 U13.20(VCC)
NetC220_1: C220.1 U13.17(3V3OUT)
NetD1_1: D1.1(A) R62.1
NetD2_1: D2.1(A) R64.2
NetD2_2: D2.2(K) U13.23(CBUS0)
NetD3_1: D3.1(A) R67.2
NetD3_2: D3.2(K) U13.22(CBUS1)
NetH1_3: H1.3 R62.2 U12.1(VDD)
NetJ2_1: J2.1(CD/DAT3/CS) U14.22(DAT3B0)
NetJ2_2: J2.2(CMD/DI) R63.1 U14.20(CMDB0)
NetJ2_5: J2.5(CLK/SCLK) U14.19(CLKB0)
NetJ2_7: J2.7(DAT0/D0) U14.18(DAT0B0)
NetJ2_8: J2.8(DAT1) U14.16(DAT1B0)
NetJ2_9: J2.9(DAT2) U14.23(DAT2B0)
NetJ2_CD: J2.CD R65.1
NetJ2_WP: J2.WP R66.1
NetR68_2: R68.2 U14.24(SEL)
NetU12_2: U12.2(D-) U13.16(USBDM)
NetU12_3: U12.3(D+) U13.15(USBDP)
NetU13_1: U13.1(TXD) ; port UART_TX
NetU13_3: U13.3(RTS#) ; port UART_RTS#
NetU13_5: U13.5(RXD) ; port UART_RX
NetU13_11: U13.11(CTS#) ; port UART_CTS#
NetU14_1: U14.1(DAT2A) ; port SD_D2
NetU14_3: U14.3(DAT3A) ; port SD_D3
NetU14_4: U14.4(CMDA) ; port SC_CMD
NetU14_6: U14.6(DAT0A) ; port SD_D0
NetU14_7: U14.7(DAT1A) ; port SD_D1
NetU14_9: U14.9(CLKA) ; port SD_CLK

Not connected (* = marked no-connect by the designer): J2 3(VSS); U12 4(ID) 5(GND) 6(SHIELD); U13 2(DTR#)* 6(RI#)* 8(NC)* 9(DSR#)* 10(DCD#)* 12(CBUS4)* 13(CBUS2)* 14(CBUS3)* 19(RESET#)* 24(NC)* 27(OSCI)* 28(OSCO)*; U14 8(DAT2B1)* 10(DAT3B1)* 12(CMDB1)* 13(CLKB1)* 14(DAT0B1)* 15(DAT1B1)*

### Notes on the sheet
- SD Card/Ethernet/UART
- SD Card Interface and Connector
- USB to UART Interface
- Ethernet Interface
- CONFIDENTAL. Do not distribute.
- Variant:
- Checked by
- (in symbol SDTitleBlock) Title:; Page Contents:; Revision:; Size:; DWG NO; Date:; Sheet; of
- (in symbol ZX62-B-5PA(11)) Micro USB Type B

### Library data of the parts
C210 C211 C217 C218 C220 = GRM188R71C104KA01D: CAP CER 0.1UF 16V X7R 0603; Manufacturer: Murata Electronics North America; Tolerance: ±10%; Supplier 1: Digi-Key; Manufacturer Part Number: GRM188R71C104KA01D; RoHS: RoHS Compliant; Category: Capacitors; Stock 1: 3229528; Pricing 1: 1=0.1, 10=0.019, 50=0.0102, 100=0.0086, 250=0.00704, 500=0.006, 1000=0.00468 (USD); Packaging: Cut Tape (CT); Voltage - Rated: 16V; Temperature Coefficient: X7R; Mounting Type: Surface Mount, MLCC; Operating Temperature: -55°C ~ 125°C; Applications: General Purpose; Ratings: -; Package / Case: 0603 (1608 Metric); Size / Dimension: 0.063" L x 0.031" W (1.60mm x 0.80mm); Height - Seated (Max): -; Thickness (Max): 0.035" (0.90mm); Lead Spacing: -; Features: -; Lead Style: -; ComponentLink1URL: http://www.murata.com/~/media/webrenewal/support/library/catalog/products/capacitor/mlcc/c02e.pdf; ComponentLink1Description: http://www.murata.com/~/media/webrenewal/support/library/catalog/products/capacitor/mlcc/c02e.pdf; Supplier Part Number 1: 490-1532-1-ND
C212 C213 = GRM188R71A225KE15D: CAP CER 2.2UF 10V X7R 0603; Manufacturer: Murata Electronics North America; Tolerance: ±10%; Supplier 1: Digi-Key; Manufacturer Part Number: GRM188R71A225KE15D; RoHS: RoHS Compliant; Category: Capacitors; Stock 1: 191595; Pricing 1: 1=0.34, 10=0.28, 50=0.1576, 100=0.14, 250=0.105, 500=0.09276, 1000=0.08225 (USD); Packaging: Cut Tape (CT); Voltage - Rated: 10V; Temperature Coefficient: X7R; Mounting Type: Surface Mount, MLCC; Operating Temperature: -55°C ~ 125°C; Applications: General Purpose; Ratings: -; Package / Case: 0603 (1608 Metric); Size / Dimension: 0.063" L x 0.031" W (1.60mm x 0.80mm); Height - Seated (Max): -; Thickness (Max): 0.035" (0.90mm); Lead Spacing: -; Features: -; Lead Style: -; ComponentLink1URL: http://www.murata.com/~/media/webrenewal/support/library/catalog/products/capacitor/mlcc/c02e.pdf; ComponentLink1Description: http://www.murata.com/~/media/webrenewal/support/library/catalog/products/capacitor/mlcc/c02e.pdf; Supplier Part Number 1: 490-4520-1-ND
C214-C216 C219 = CGA2B1X7R1C104K050BC: CAP CER 0.1UF 16V X7R 0402; Manufacturer: TDK Corporation; Tolerance: ±10%; Supplier 1: Digi-Key; Manufacturer Part Number: CGA2B1X7R1C104K050BC; RoHS: RoHS Compliant; Category: Capacitors; Stock 1: 413079; Pricing 1: 1=0.1, 10=0.042, 100=0.0193, 250=0.01576, 500=0.01348, 1000=0.0105, 5000=0.00875 (USD); Packaging: Cut Tape (CT); Voltage - Rated: 16V; Temperature Coefficient: X7R; Mounting Type: Surface Mount, MLCC; Operating Temperature: -55°C ~ 125°C; Applications: Automotive; Ratings: AEC-Q200; Package / Case: 0402 (1005 Metric); Size / Dimension: 0.039" L x 0.020" W (1.00mm x 0.50mm); Height - Seated (Max): -; Thickness (Max): 0.022" (0.55mm); Lead Spacing: -; Features: -; Lead Style: -; ComponentLink1URL: https://product.tdk.com/info/en/catalog/datasheets/mlcc_automotive_general_en.pdf; ComponentLink1Description: https://product.tdk.com/info/en/catalog/datasheets/mlcc_automotive_general_en.pdf; Supplier Part Number 1: 445-5613-1-ND
D1 = SMLE12WBC7W1: LED WHITE DIFFUSED 0603 SMD; Manufacturer: Rohm Semiconductor; Millicandela Rating: 71mcd; Lens Style/Size: Rectangle with Flat Top, 1.20mm x 0.80mm; Voltage - Forward (Vf) (Typ): 2.9V; Current - Test: 5mA; Supplier 1: Digi-Key; Manufacturer Part Number: SMLE12WBC7W1; RoHS: RoHS Compliant; Category: Optoelectronics; Stock 1: 29713; Pricing 1: 1=0.75, 10=0.578, 25=0.48, 100=0.4125, 250=0.36, 500=0.315, 1000=0.2475, 2500=0.225 (USD); Packaging: Cut Tape (CT); Lens Color: White; Lens Transparency: Diffused; Viewing Angle: -; Mounting Type: Surface Mount; Wavelength - Dominant: -; Wavelength - Peak: -; Features: -; Package / Case: 0603 (1608 Metric); Supplier Device Package: 0603 (1608 Metric); Size / Dimension: 1.60mm L x 0.80mm W; Height (Max): 0.46mm; ComponentLink1URL: http://rohmfs.rohm.com/en/products/databook/datasheet/opto/led/chip_mono/sml-e1.pdf; ComponentLink1Description: http://rohmfs.rohm.com/en/products/databook/datasheet/opto/led/chip_mono/sml-e1.pdf; Supplier Part Number 1: 511-1602-1-ND
D2 D3 = LB Q39E-N1OO-35-1: LED BLUE DIFFUSED 0603 SMD; Manufacturer: OSRAM Opto Semiconductors Inc.; Lens Color: White; Millicandela Rating: 42mcd; Lens Style/Size: Rectangle with Flat Top, 1.10mm x 0.80mm; Voltage - Forward (Vf) (Typ): 2.85V; Current - Test: 5mA; Viewing Angle: 170°, 130°; Wavelength - Dominant: 470nm; Wavelength - Peak: 465nm; Supplier 1: Digi-Key; Manufacturer Part Number: LB Q39E-N1OO-35-1; RoHS: RoHS Compliant; Category: Optoelectronics; Stock 1: 39129; Pricing 1: 1=0.35, 10=0.268, 25=0.2184, 100=0.1736, 250=0.1488, 500=0.12896, 1000=0.0992 (USD); Packaging: Cut Tape (CT); Lens Transparency: Diffused; Mounting Type: Surface Mount; Features: -; Package / Case: 0603 (1608 Metric); Supplier Device Package: *; Size / Dimension: 1.60mm L x 0.80mm W; Height (Max): 0.40mm; ComponentLink1URL: http://www.osram-os.com/Graphics/XPic5/00124611_0.pdf; ComponentLink1Description: http://www.osram-os.com/Graphics/XPic5/00124611_0.pdf; Supplier Part Number 1: 475-2815-1-ND
H1 = 68001-203HLF: BERGSTIK II .100" SR STRAIGHT; Manufacturer: Amphenol FCI; Connector Type: Header, Unshrouded; Number of Positions: 3; Number of Positions Loaded: All; Pitch: 0.100" (2.54mm); Supplier 1: Digi-Key; Manufacturer Part Number: 68001-203HLF; RoHS: RoHS Compliant; Category: Connectors, Interconnects; Stock 1: 7857; Pricing 1: 1=0.19, 10=0.182, 25=0.1556, 50=0.136, 100=0.1264, 250=0.1118, 500=0.10692, 1000=0.08748, 2500=0.08019 (USD); Packaging: Bulk; Contact Type: Male Pin; Number of Rows: 1; Row Spacing: -; Contact Mating Length: 0.230" (5.84mm); Mounting Type: Through Hole; Termination: Solder; Fastening Type: -; Features: -; Contact Finish: Gold or Gold, GXT™; Contact Finish Thickness: 15µin (0.38µm); Color: Black; ComponentLink1URL: http://portal.fciconnect.com/Comergent//fci/drawing/68000.pdf; ComponentLink1Description: http://portal.fciconnect.com/Comergent//fci/drawing/68000.pdf; Supplier Part Number 1: 609-3470-ND
J2 = 2041021-4: CONN SD CARD PUSH-PULL R/A SMD; Manufacturer: TE Connectivity AMP Connectors; Card Type: Secure Digital - SD; Number of Positions: 11 (9 + 2); Connector Type: Connector; Insertion, Removal Method: Push In, Pull Out; Supplier 1: Digi-Key; Manufacturer Part Number: 2041021-4; RoHS: RoHS Compliant; Category: Connectors, Interconnects; Stock 1: 3592; Pricing 1: 1=3.1, 25=2.76, 50=2.3, 100=2.07 (USD); Packaging: Cut Tape (CT); Ejector Side: -; Mounting Type: Surface Mount, Right Angle; Features: Board Guide, Switch; Height Above Board: 0.130" (3.30mm); Mounting Feature: Normal, Standard - Top; Contact Finish: Gold; Contact Finish Thickness: 10µin (0.25µm); ComponentLink1URL: http://www.te.com/commerce/DocumentDelivery/DDEController?Action=srchrtrv&DocNm=2041021&DocType=Customer+Drawing&DocLang=English; ComponentLink1Description: http://www.te.com/commerce/DocumentDelivery/DDEController?Action=srchrtrv&DocNm=2041021&DocType=Customer+Drawing&DocLang=English; Supplier Part Number 1: A101492CT-ND
R62 = ERJ-3EKF1001V: RES SMD 1K OHM 1% 1/10W 0603; Manufacturer: Panasonic Electronic Components; Power (Watts): 0.1W, 1/10W; Temperature Coefficient: ±100ppm/°C; Supplier 1: Digi-Key; Manufacturer Part Number: ERJ-3EKF1001V; RoHS: RoHS Compliant; Category: Resistors; Stock 1: 6439941; Pricing 1: 1=0.1, 50=0.0114, 100=0.0084, 250=0.00644, 500=0.00514, 1000=0.00379 (USD); Packaging: Cut Tape (CT); Tolerance: ±1%; Composition: Thick Film; Features: Automotive AEC-Q200; Operating Temperature: -55°C ~ 155°C; Package / Case: 0603 (1608 Metric); Supplier Device Package: 0603; Size / Dimension: 0.063" L x 0.031" W (1.60mm x 0.80mm); Height: 0.022" (0.55mm); Number of Terminations: 2; ComponentLink1URL: http://industrial.panasonic.com/www-cgi/jvcr13pz.cgi?E+PZ+3+AOA0002+ERJ3EKF1001V+7+WW; ComponentLink1Description: http://industrial.panasonic.com/www-cgi/jvcr13pz.cgi?E+PZ+3+AOA0002+ERJ3EKF1001V+7+WW; Supplier Part Number 1: P1.00KHCT-ND
R63 R68 = ERJ-3EKF4701V: RES SMD 4.7K OHM 1% 1/10W 0603; Manufacturer: Panasonic Electronic Components; Power (Watts): 0.1W, 1/10W; Temperature Coefficient: ±100ppm/°C; Supplier 1: Digi-Key; Manufacturer Part Number: ERJ-3EKF4701V; RoHS: RoHS Compliant; Category: Resistors; Stock 1: 3227786; Pricing 1: 1=0.1, 50=0.0114, 100=0.0084, 250=0.00644, 500=0.00514, 1000=0.00379 (USD); Packaging: Cut Tape (CT); Tolerance: ±1%; Composition: Thick Film; Features: Automotive AEC-Q200; Operating Temperature: -55°C ~ 155°C; Package / Case: 0603 (1608 Metric); Supplier Device Package: 0603; Size / Dimension: 0.063" L x 0.031" W (1.60mm x 0.80mm); Height: 0.022" (0.55mm); Number of Terminations: 2; ComponentLink1URL: http://industrial.panasonic.com/www-cgi/jvcr13pz.cgi?E+PZ+3+AOA0002+ERJ3EKF4701V+7+WW; ComponentLink1Description: http://industrial.panasonic.com/www-cgi/jvcr13pz.cgi?E+PZ+3+AOA0002+ERJ3EKF4701V+7+WW; Supplier Part Number 1: P4.70KHCT-ND
R64 R67 = ERJ-3EKF3300V: RES SMD 330 OHM 1% 1/10W 0603; Manufacturer: Panasonic Electronic Components; Power (Watts): 0.1W, 1/10W; Temperature Coefficient: ±100ppm/°C; Supplier 1: Digi-Key; Manufacturer Part Number: ERJ-3EKF3300V; RoHS: RoHS Compliant; Category: Resistors; Stock 1: 608815; Pricing 1: 1=0.1, 50=0.0114, 100=0.0084, 250=0.00644, 500=0.00514, 1000=0.00379 (USD); Packaging: Cut Tape (CT); Tolerance: ±1%; Composition: Thick Film; Features: Automotive AEC-Q200; Operating Temperature: -55°C ~ 155°C; Package / Case: 0603 (1608 Metric); Supplier Device Package: 0603; Size / Dimension: 0.063" L x 0.031" W (1.60mm x 0.80mm); Height: 0.022" (0.55mm); Number of Terminations: 2; ComponentLink1URL: http://industrial.panasonic.com/www-cgi/jvcr13pz.cgi?E+PZ+3+AOA0002+ERJ3EKF3300V+7+WW; ComponentLink1Description: http://industrial.panasonic.com/www-cgi/jvcr13pz.cgi?E+PZ+3+AOA0002+ERJ3EKF3300V+7+WW; Supplier Part Number 1: P330HCT-ND
R65 R66 = ERJ-3EKF4990V: RES SMD 499 OHM 1% 1/10W 0603; Manufacturer: Panasonic Electronic Components; Power (Watts): 0.1W, 1/10W; Temperature Coefficient: ±100ppm/°C; Supplier 1: Digi-Key; Manufacturer Part Number: ERJ-3EKF4990V; RoHS: RoHS Compliant; Category: Resistors; Stock 1: 801148; Pricing 1: 1=0.1, 50=0.0114, 100=0.0084, 250=0.00644, 500=0.00514, 1000=0.00379 (USD); Packaging: Cut Tape (CT); Tolerance: ±1%; Composition: Thick Film; Features: Automotive AEC-Q200; Operating Temperature: -55°C ~ 155°C; Package / Case: 0603 (1608 Metric); Supplier Device Package: 0603; Size / Dimension: 0.063" L x 0.031" W (1.60mm x 0.80mm); Height: 0.022" (0.55mm); Number of Terminations: 2; ComponentLink1URL: http://industrial.panasonic.com/www-cgi/jvcr13pz.cgi?E+PZ+3+AOA0002+ERJ3EKF4990V+7+WW; ComponentLink1Description: http://industrial.panasonic.com/www-cgi/jvcr13pz.cgi?E+PZ+3+AOA0002+ERJ3EKF4990V+7+WW; Supplier Part Number 1: P499HCT-ND
U12 = ZX62-B-5PA(11): CONN RCPT MICRO USB B SMD R/A; Manufacturer: Hirose Electric Co Ltd; Connector Type: USB - micro B; Number of Contacts: 5; Gender: Receptacle; Specifications: USB 2.0; Supplier 1: Digi-Key; Manufacturer Part Number: ZX62-B-5PA(11); RoHS: RoHS Compliant; Category: Connectors, Interconnects; Stock 1: 35202; Pricing 1: 1=0.96, 10=0.842, 25=0.792, 50=0.759, 100=0.726, 250=0.66, 500=0.594, 1000=0.528 (USD); Packaging: Cut Tape (CT); Mounting Type: Surface Mount, Right Angle, Horizontal; Features: -; Ingress Protection: -; ComponentLink1URL: http://www.hirose.co.jp/cataloge_hp/ed_ZX_20140804.pdf; ComponentLink1Description: http://www.hirose.co.jp/cataloge_hp/ed_ZX_20140804.pdf; Supplier Part Number 1: H11634CT-ND
U13 = FT232RL-REEL: IC USB FS SERIAL UART 28-SSOP; Manufacturer: FTDI, Future Technology Devices International Ltd; Function: Bridge, USB to UART; Standards: USB 2.0; Voltage - Supply: 3.3 V ~ 5.25 V; Current - Supply: 15mA; Supplier 1: Digi-Key; Manufacturer Part Number: FT232RL-REEL; RoHS: RoHS Compliant; Category: Integrated Circuits (ICs); Stock 1: 106715; Pricing 1: 1=4.5, 10=4.05, 50=3.85, 100=3.65, 250=3.25, 500=2.85 (USD); Packaging: Cut Tape (CT); Protocol: USB; Interface: UART; Operating Temperature: -40°C ~ 85°C; Package / Case: 28-SSOP (0.209", 5.30mm Width); Supplier Device Package: 28-SSOP; ComponentLink1URL: http://www.ftdichip.com/Support/Documents/DataSheets/ICs/DS_FT232R.pdf; ComponentLink1Description: http://www.ftdichip.com/Support/Documents/DataSheets/ICs/DS_FT232R.pdf; Supplier Part Number 1: 768-1007-1-ND
U14 = TXS02612RTWR: IC SDIO PORT EXPANDER 24WQFN; Manufacturer: Texas Instruments; Voltage - Supply: 1.1 V ~ 3.6 V; Supplier 1: Digi-Key; Manufacturer Part Number: TXS02612RTWR; RoHS: RoHS Compliant; Category: Integrated Circuits (ICs); Stock 1: 9728; Pricing 1: 1=1.6, 10=1.429, 100=1.1139, 500=0.9212, 1000=0.7285 (USD); Packaging: Cut Tape (CT); Applications: Cell Phone; Interface: SDIO; Package / Case: 24-WQFN Exposed Pad; Supplier Device Package: 24-WQFN (4x4); Mounting Type: Surface Mount; ComponentLink1URL: http://www.ti.com/lit/ds/symlink/txs02612.pdf; ComponentLink1Description: http://www.ti.com/lit/ds/symlink/txs02612.pdf; Supplier Part Number 1: 296-23869-1-ND

## Nets that join several sheets
DDR0V75: [05] - POWER REGULATION (7 pins), [06] - MEMORY (35 pins)
DDR1V5: [04] - ZYNQ POWER AND JTAG (9 pins), [06] - MEMORY (89 pins)
GND: [04] - ZYNQ POWER AND JTAG (183 pins), [05] - POWER REGULATION (89 pins), [06] - MEMORY (88 pins), [08] - SD_Card and Ethernet (22 pins)
VCC1V0: [04] - ZYNQ POWER AND JTAG (59 pins), [05] - POWER REGULATION (5 pins)
VCC1V5: [05] - POWER REGULATION (6 pins), [06] - MEMORY (FB1.2)
VCC1V8: [04] - ZYNQ POWER AND JTAG (24 pins), [05] - POWER REGULATION (C209.1 U9.13 U9.14), [08] - SD_Card and Ethernet (C214.1 C215.1 U14.5)
VCC3V3: [04] - ZYNQ POWER AND JTAG (91 pins), [05] - POWER REGULATION (C204.2 C205.2 U8.3), [08] - SD_Card and Ethernet (9 pins)
VCC5V0: [05] - POWER REGULATION (33 pins), [08] - SD_Card and Ethernet (H1.1 R64.1 R67.1)